# Altium schematic sheet ext.SchDoc
size 209 x 297 mm; SheetNumber: 1; SheetTotal: 1
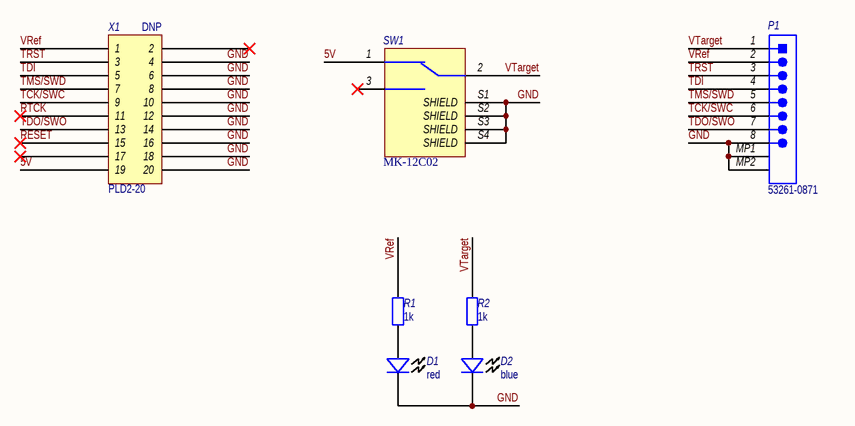
[diagram p0: ext.SchDoc]

## Parts
D1  value red  [LED_0603]  (hidden comment: LED)
D2  value blue  [LED_0603]  (hidden comment: LED)
P1  PicoBlade_53261-0871  [53261-0871]  (value not drawn)
R1  value 1k  [SMD_0603]  (hidden comment: OSM R1-8)
R2  value 1k  [SMD_0603]  (hidden comment: OSM R1-8)
SW1  MK-12C02  [PCBComponent_1]
X1  Наименование: PLD2-20  [DS1013-20R]  (hidden comment: Header 2X20)

## Nets
5V: SW1.1 X1.19
GND: D1.2(K) D2.2(K) P1.8 P1.MP1 P1.MP2 SW1.S1(SHIELD) SW1.S2(SHIELD) SW1.S3(SHIELD) SW1.S4(SHIELD) X1.4 X1.6 X1.8 X1.10 X1.12 X1.14 X1.16 X1.18 X1.20
RESET: X1.15
RTCK: X1.11
TCK/SWC: P1.6 X1.9
TDI: P1.4 X1.5
TDO/SWO: P1.7 X1.13
TMS/SWD: P1.5 X1.7
TRST: P1.3 X1.3
VRef: P1.2 R1.2 X1.1
VTarget: P1.1 R2.2 SW1.2
NetD1_1: D1.1(A) R1.1
NetD2_1: D2.1(A) R2.1

Not connected (* = marked no-connect by the designer): SW1 3*; X1 2* 17*

## Notes on the sheet
- Перв. примен.
- Справ. №
- Подп. и дата
- Инв. № дубл.
- Взам. инв. №
- Разраб.
- Изм.
- Лист
- № докум.
- Подп.
- Дата
- Литера
- Масса
- Масштаб
- Пров.
- Т.контр.
- Листов
- Инв. № подл.
- Н.контр.
- Утв.
- Форма 1 ГОСТ 2.104-2006
- Копировал
- Формат А4

## Library data of the parts
D1 D2 = LED: Назначение: Светодиод; Наименование: SMD-LED; Потребление, Вт: 0,01
P1 = PicoBlade_53261-0871: Male Header, Pitch 1.25 mm, 1 x 8 Position, Height 3.4 mm, -40 to 85 degC, RoHS, Tape and Reel; Потребление, Вт: 0.0; Назначение: Male Header, Pitch 1.25 mm, 1 x 8 Position, Height 3.4 mm, -40 to 85 degC, RoHS, Tape and Reel; ComponentLink1Description: DataSheet; ComponentLink1URL: http://www.molex.com/pdm_docs/sd/532610671_sd.pdf; Наименование: 53261-0871
R1 R2 = Resistor: Наименование: ОСМ Р1-12; Назначение: SMD-резистор; Потребление, Вт: 0,001; Точность: %
SW1 = MK-12C02: Surface Mount, Right Angle 1A SPDT 6V Black 10,000 Cycles SMD,6.6x1.4mm Slide Switches
X1 = Header 2X20: Header, 20-Pin, Dual row; Потребление, Вт: 0,0; Назначение: Header, 20-Pin, Dual row; DNP: DNP